# Altium schematic sheet main-sch.SchDoc
size A4
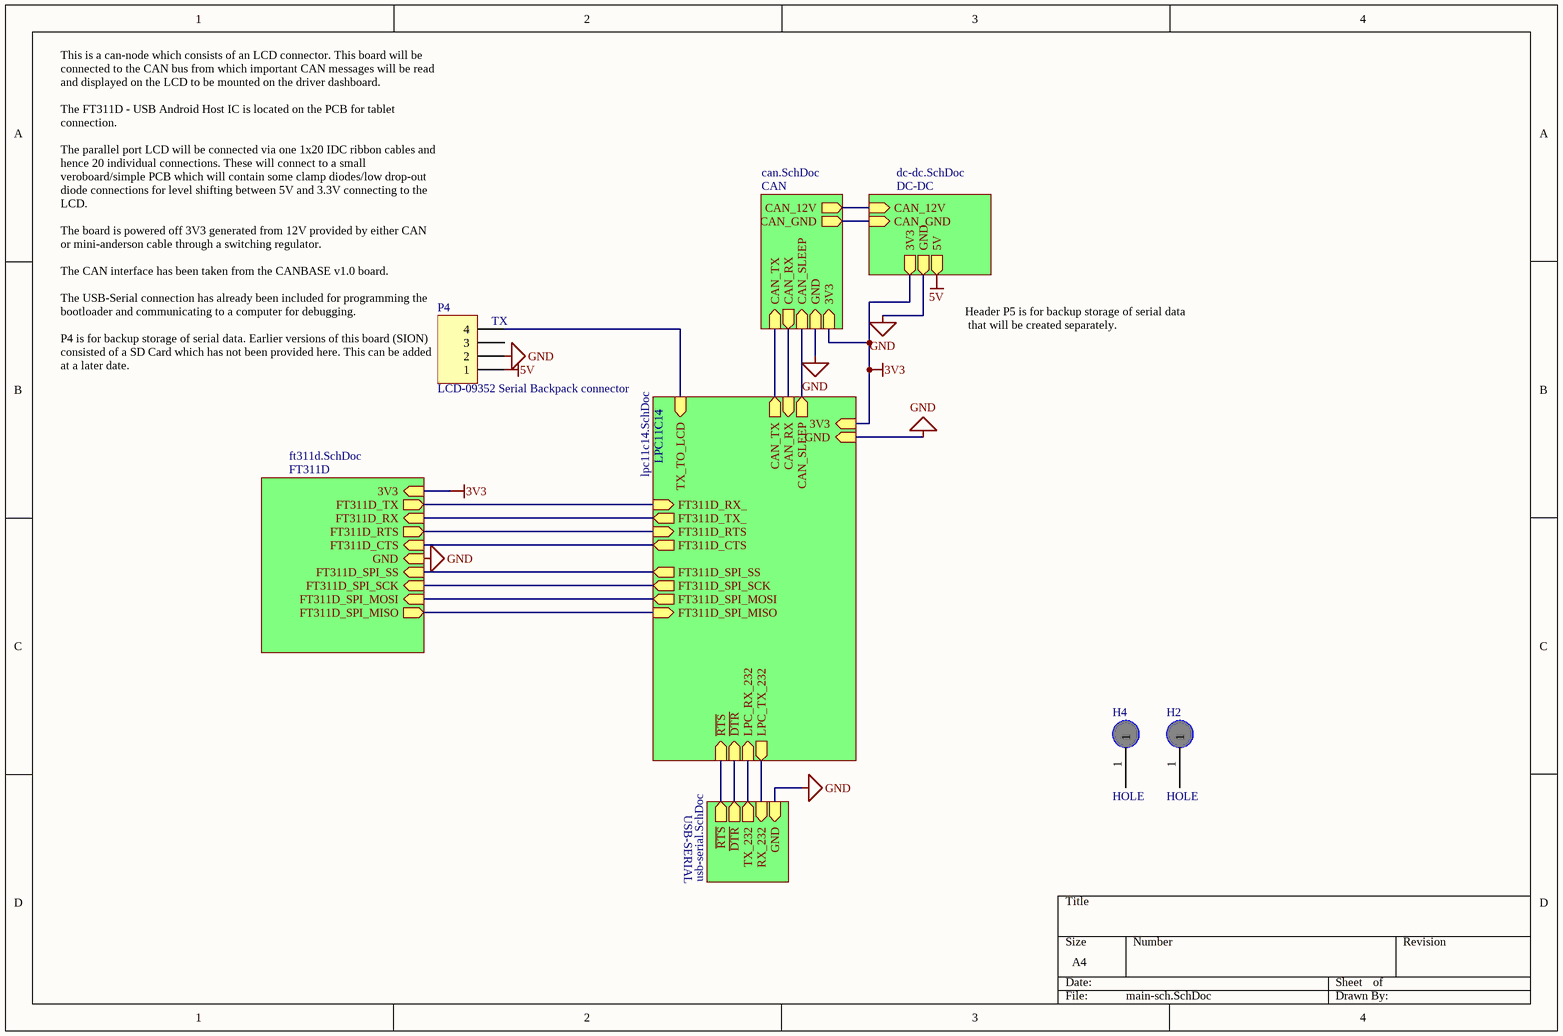
[diagram p0: main-sch.SchDoc]

## Parts
H2  HOLE  [M2.5]
H4  HOLE  [M2.5]
P4  Header 4  [HDR1X4]  (value not drawn)

## Sub-sheets
CAN = can.SchDoc: CAN_TX (in), CAN_RX (out), 3V3 (in), GND (in), CAN_12V (out), CAN_GND (out), CAN_SLEEP (in)
DC-DC = dc-dc.SchDoc: 3V3 (out), GND (out), CAN_12V (in), 5V (out), CAN_GND (in)
FT311D = ft311d.SchDoc: FT311D_TX (out), FT311D_RX (in), FT311D_RTS (out), FT311D_CTS (in), 3V3 (in), GND (in), FT311D_SPI_SS (in), FT311D_SPI_SCK (in), FT311D_SPI_MOSI (in), FT311D_SPI_MISO (out)
LPC11C14 = lpc11c14.SchDoc: CAN_TX (out), CAN_RX (in), LPC_TX_232 (out), LPC_RX_232 (in), FT311D_RX_ (in), FT311D_TX_ (out), ~{DTR} (in), ~{RTS} (in), TX_TO_LCD (in), 3V3 (in), GND (in), FT311D_RTS (in), FT311D_CTS (out), FT311D_SPI_SS (out), FT311D_SPI_SCK (out), FT311D_SPI_MOSI (out), FT311D_SPI_MISO (in), CAN_SLEEP (out)
USB-SERIAL = usb-serial.SchDoc: RX_232 (in), TX_232 (out), ~{RTS} (out), ~{DTR} (out), GND (in)

## Nets
3V3: sheet CAN/3V3, sheet FT311D/3V3, sheet LPC11C14/3V3, sheet DC-DC/3V3
5V: P4.1 ; sheet DC-DC/5V
GND: P4.2 ; sheet CAN/GND, sheet FT311D/GND, sheet LPC11C14/GND, sheet DC-DC/GND, sheet USB-SERIAL/GND
NetP4_4: P4.4 ; sheet LPC11C14/TX_TO_LCD
(unnamed): sheet CAN/CAN_TX, sheet LPC11C14/CAN_TX
(unnamed): sheet CAN/CAN_RX, sheet LPC11C14/CAN_RX
(unnamed): sheet CAN/CAN_12V, sheet DC-DC/CAN_12V
(unnamed): sheet CAN/CAN_GND, sheet DC-DC/CAN_GND
(unnamed): sheet CAN/CAN_SLEEP, sheet LPC11C14/CAN_SLEEP
(unnamed): sheet FT311D/FT311D_TX, sheet LPC11C14/FT311D_RX_
(unnamed): sheet FT311D/FT311D_RX, sheet LPC11C14/FT311D_TX_
(unnamed): sheet FT311D/FT311D_RTS, sheet LPC11C14/FT311D_RTS
(unnamed): sheet FT311D/FT311D_CTS, sheet LPC11C14/FT311D_CTS
(unnamed): sheet FT311D/FT311D_SPI_SS, sheet LPC11C14/FT311D_SPI_SS
(unnamed): sheet FT311D/FT311D_SPI_SCK, sheet LPC11C14/FT311D_SPI_SCK
(unnamed): sheet FT311D/FT311D_SPI_MOSI, sheet LPC11C14/FT311D_SPI_MOSI
(unnamed): sheet FT311D/FT311D_SPI_MISO, sheet LPC11C14/FT311D_SPI_MISO
(unnamed): sheet LPC11C14/LPC_TX_232, sheet USB-SERIAL/RX_232
(unnamed): sheet LPC11C14/LPC_RX_232, sheet USB-SERIAL/TX_232
(unnamed): sheet LPC11C14/~{DTR}, sheet USB-SERIAL/~{DTR}
(unnamed): sheet LPC11C14/~{RTS}, sheet USB-SERIAL/~{RTS}

Not connected (* = marked no-connect by the designer): H2 1; H4 1; P4 3

## Notes on the sheet
- (near P4) This is a can-node which consists of an LCD connector. This board will be connected to the CAN bus from which important CAN messages will be read and displayed on the LCD to be mounted on the driver dashboard.
  The FT311D - USB Android Host IC is located on the PCB for tablet connection.
  The parallel port LCD will be connected via one 1x20 IDC ribbon cables and hence 20 individual connections. These will connect to a small veroboard/simple PCB which will contain some clamp diodes/low drop-out diode connections for level shifting between 5V and 3.3V connecting to the LCD.
  The board is powered off 3V3 generated from 12V provided by either CAN or mini-anderson cable through a switching regulator.
  The CAN interface has been taken from the CANBASE v1.0 board.
  The USB-Serial connection has already been included for programming the bootloader and communicating to a computer for debugging.
  P4 is for backup storage of serial data. Earlier versions of this board (SION) consisted of a SD Card which has not been provided here. This can be added at a later date.
- (near P4) TX
- Header P5 is for backup storage of serial data
  that will be created separately.
- (near P4) LCD-09352 Serial Backpack connector

## Library data of the parts
P4 = Header 4: Header, 4-Pin; LatestRevisionDate: 17-Jul-2002; LatestRevisionNote: Re-released for DXP Platform.; Publisher: Altium Limited